# Altium project LSW-MONO.PrjPcb
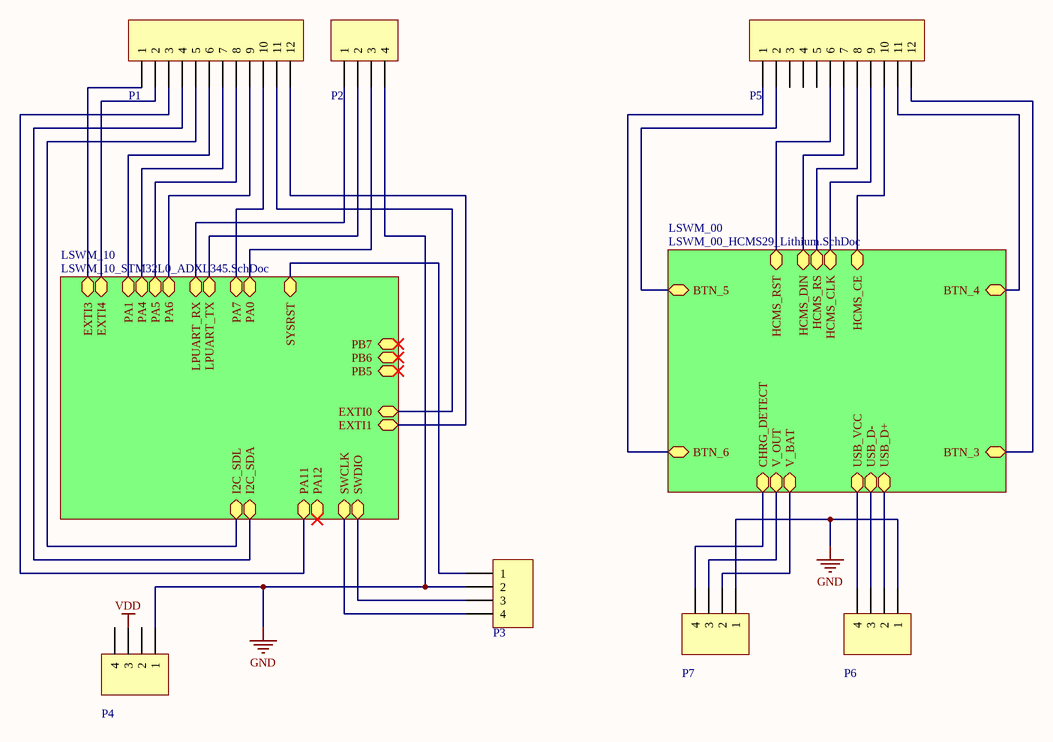
[diagram p0: LSW_0_HCMS29_STM32L0.SchDoc]
3 sheets, 47 parts. Net scope: hierarchical (ports join the sheet entries above them; power ports are global).
Board file: PCB1.PcbDoc
Sheets:
  LSW_0_HCMS29_STM32L0.SchDoc
    LSWM_10 = LSWM_10_STM32L0_ADXL345.SchDoc
    LSWM_00 = LSWM_00_HCMS29_Lithium.SchDoc

## Sheet LSW_0_HCMS29_STM32L0.SchDoc
size A4

### Parts
P1  Header 12  [HDR12X1_1.27mm]  (value not drawn)
P2  Header 4  [HDR4X1_1.27mm]  (value not drawn)
P3  Header 4  [HDR4X1_1.27mm]  (value not drawn)
P4  Header 4  [HDR4X1_1.27mm]  (value not drawn)
P5  Header 12  [HDR12X1_1.27mm]  (value not drawn)
P6  Header 4  [HDR4X1_1.27mm]  (value not drawn)
P7  Header 4  [HDR4X1_1.27mm]  (value not drawn)

### Sub-sheets
LSWM_00 = LSWM_00_HCMS29_Lithium.SchDoc: HCMS_RST, HCMS_DIN, HCMS_RS, HCMS_CLK, HCMS_CE, BTN_3, BTN_4, BTN_5, BTN_6, V_BAT, V_OUT, CHRG_DETECT, USB_VCC, USB_D+, USB_D-
LSWM_10 = LSWM_10_STM32L0_ADXL345.SchDoc: EXTI0, EXTI1, EXTI3, EXTI4, PA7, PA6, PA5, PA4, LPUART_RX, LPUART_TX, SYSRST, SWDIO, SWCLK, PA12, PA11, I2C_SDA, I2C_SDL, PB5, PB6, PB7, PA0, PA1

### Nets
3V3: P7.3 ; sheet LSWM_00/V_OUT
GND: P2.4 P3.2 P4.1 P6.1 P7.1
VBAT: P7.2 ; sheet LSWM_00/V_BAT
VDD: P4.3
STM32L0_EXTI0: P1.11 ; sheet LSWM_10/EXTI0
STM32L0_EXTI1: P1.12 ; sheet LSWM_10/EXTI1
STM32L0_EXTI3: P1.1 ; sheet LSWM_10/EXTI3
STM32L0_EXTI4: P1.2 ; sheet LSWM_10/EXTI4
STM32L0_I2C1_SCL: P1.5 ; sheet LSWM_10/I2C_SDL
STM32L0_I2C1_SDA: P1.4 ; sheet LSWM_10/I2C_SDA
STM32L0_LPUART_RX: P2.1 ; sheet LSWM_10/LPUART_RX
STM32L0_LPUART_TX: P2.2 ; sheet LSWM_10/LPUART_TX
STM32L0_NRST: P3.1 ; sheet LSWM_10/SYSRST
STM32L0_PA0: P2.3 ; sheet LSWM_10/PA0
STM32L0_PA1: P1.6 ; sheet LSWM_10/PA1
STM32L0_PA4: P1.7 ; sheet LSWM_10/PA4
STM32L0_PA5: P1.8 ; sheet LSWM_10/PA5
STM32L0_PA6: P1.9 ; sheet LSWM_10/PA6
STM32L0_PA7: P1.10 ; sheet LSWM_10/PA7
STM32L0_PA11: P1.3 ; sheet LSWM_10/PA11
STM32L0_SWCLK: P3.4 ; sheet LSWM_10/SWCLK
STM32L0_SWDIO: P3.3 ; sheet LSWM_10/SWDIO
NetD1_2: P7.4 ; sheet LSWM_00/CHRG_DETECT
NetJ1_1: P6.4 ; sheet LSWM_00/USB_VCC
NetJ1_2: P6.3 ; sheet LSWM_00/USB_D-
NetJ1_3: P6.2 ; sheet LSWM_00/USB_D+
NetP5_1: P5.1 ; sheet LSWM_00/BTN_6
NetP5_2: P5.2 ; sheet LSWM_00/BTN_5
NetP5_6: P5.6 ; sheet LSWM_00/HCMS_RST
NetP5_7: P5.7 ; sheet LSWM_00/HCMS_DIN
NetP5_8: P5.8 ; sheet LSWM_00/HCMS_RS
NetP5_9: P5.9 ; sheet LSWM_00/HCMS_CLK
NetP5_10: P5.10 ; sheet LSWM_00/HCMS_CE
NetP5_11: P5.11 ; sheet LSWM_00/BTN_4
NetP5_12: P5.12 ; sheet LSWM_00/BTN_3

Not connected (* = marked no-connect by the designer): P4 2 4; P5 3 4 5

### Library data of the parts
P1 P5 = Header 12: 接插件; LatestRevisionDate: 17-Jul-2002; LatestRevisionNote: Re-released for DXP Platform.; Publisher: Altium Limited
P2-P4 P6 P7 = Header 4: 接插件; LatestRevisionDate: 17-Jul-2002; LatestRevisionNote: Re-released for DXP Platform.; Publisher: Altium Limited

## Sheet LSWM_10_STM32L0_ADXL345.SchDoc
size A4
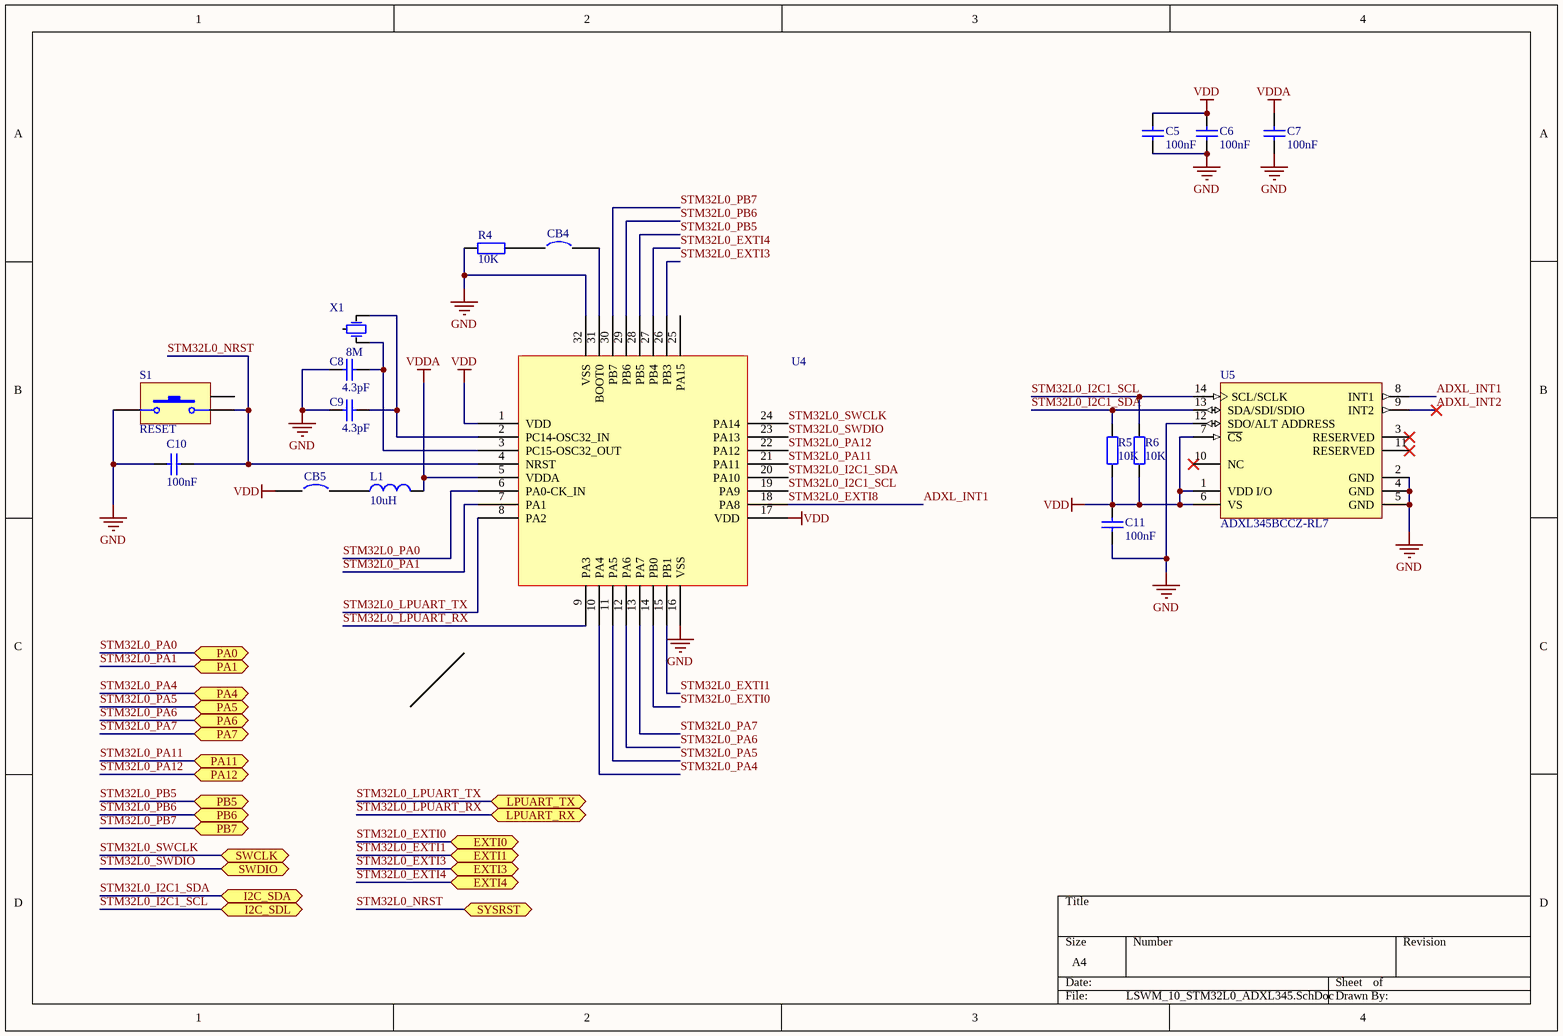
[diagram p1: LSWM_10_STM32L0_ADXL345.SchDoc]

### Parts
C5  value 100nF  [C-RAD-0603]  (hidden comment: Cap)
C6  value 100nF  [C-RAD-0603]  (hidden comment: Cap)
C7  value 100nF  [C-RAD-0603]  (hidden comment: Cap)
C8  value 4.3pF  [C-RAD-0603]  (hidden comment: Cap)
C9  value 4.3pF  [C-RAD-0603]  (hidden comment: Cap)
C10  value 100nF  [C-RAD-0603]  (hidden comment: Cap)
C11  value 100nF  [C-RAD-0603]  (hidden comment: Cap)
CB4  Circuit Breaker  [SB-0805]  (value not drawn)
CB5  Circuit Breaker  [SB-0805]  (value not drawn)
L1  value 10uH  [0805-1]  (hidden comment: Inductor)
R4  value 10K  [0603-1]  (hidden comment: Res1)
R5  value 10K  [0603-1]  (hidden comment: Res1)
R6  value 10K  [0603-1]  (hidden comment: Res1)
S1  RESET  [BTN_2_4_35]
U4  STM32L031K6  [TQFP80P900X900X160-32N]  (value not drawn)
U5  ADXL345BCCZ-RL7  [LGA80P300X500-14N]
X1  value 8M  [X-2X6C - duplicate]  (hidden comment: XTAL_SM)

### Ports
EXTI0 (bidir), EXTI1 (bidir), EXTI3 (bidir), EXTI4 (bidir), I2C_SDA (bidir), I2C_SDL (bidir), LPUART_RX (bidir), LPUART_TX (bidir), PA0 (bidir), PA1 (bidir), PA4 (bidir), PA5 (bidir), PA6 (bidir), PA7 (bidir), PA11 (bidir), PA12 (bidir), PB5 (bidir), PB6 (bidir), PB7 (bidir), SWCLK (bidir), SWDIO (bidir), SYSRST (bidir)

### Nets
GND: C5.2 C6.1 C7.1 C8.1 C9.1 C10.1 C11.1 R4.1 S1.1 U4.16(VSS) U4.32(VSS) U5.2(GND) U5.4(GND) U5.5(GND) U5.12(SDO/ALT_ADDRESS)
VDD: C5.1 C6.2 C11.2 CB5.1 R5.1 R6.1 U4.1(VDD) U4.17(VDD) U5.1(VDD_I/O) U5.6(VS) U5.7(~{CS})
VDDA: C7.2 L1.2 U4.5(VDDA)
ADXL_INT1: U4.18(PA8) U5.8(INT1)  [also labelled STM32L0_EXTI8]
ADXL_INT2: U5.9(INT2)
STM32L0_EXTI0: U4.14(PB0) ; port EXTI0
STM32L0_EXTI1: U4.15(PB1) ; port EXTI1
STM32L0_EXTI3: U4.26(PB3) ; port EXTI3
STM32L0_EXTI4: U4.27(PB4) ; port EXTI4
STM32L0_I2C1_SCL: R6.2 U4.19(PA9) U5.14(SCL/SCLK) ; port I2C_SDL
STM32L0_I2C1_SDA: R5.2 U4.20(PA10) U5.13(SDA/SDI/SDIO) ; port I2C_SDA
STM32L0_LPUART_RX: U4.9(PA3) ; port LPUART_RX
STM32L0_LPUART_TX: U4.8(PA2) ; port LPUART_TX
STM32L0_NRST: C10.2 S1.2 U4.4(NRST) ; port SYSRST
STM32L0_PA0: U4.6(PA0-CK_IN) ; port PA0
STM32L0_PA1: U4.7(PA1) ; port PA1
STM32L0_PA4: U4.10(PA4) ; port PA4
STM32L0_PA5: U4.11(PA5) ; port PA5
STM32L0_PA6: U4.12(PA6) ; port PA6
STM32L0_PA7: U4.13(PA7) ; port PA7
STM32L0_PA11: U4.21(PA11) ; port PA11
STM32L0_PA12: U4.22(PA12) ; port PA12
STM32L0_PB5: U4.28(PB5) ; port PB5
STM32L0_PB6: U4.29(PB6) ; port PB6
STM32L0_PB7: U4.30(PB7) ; port PB7
STM32L0_SWCLK: U4.24(PA14) ; port SWCLK
STM32L0_SWDIO: U4.23(PA13) ; port SWDIO
NetC8_2: C8.2 U4.3(PC15-OSC32_OUT) X1.2(OSC2)
NetC9_2: C9.2 U4.2(PC14-OSC32_IN) X1.1(OSC1)
NetCB4_1: CB4.1 R4.2
NetCB4_2: CB4.2 U4.31(BOOT0)
NetCB5_2: CB5.2 L1.1

Not connected (* = marked no-connect by the designer): S1 3; U4 25(PA15); U5 3(RESERVED)* 10(NC)* 11(RESERVED)*; X1 3

### Library data of the parts
C5-C11 = Cap: 无极性电容; Published: 8-Jun-2000; LatestRevisionDate: 17-Jul-2002; LatestRevisionNote: Re-released for DXP Platform.; PackageReference: RAD-0.3; Publisher: Altium Limited
L1 = Inductor: 电感; Code_IEC: 1005; Published: 8-Jun-2000; LatestRevisionDate: 17-Jul-2002; LatestRevisionNote: Re-released for DXP Platform.; PackageReference: 0402-A; Publisher: Altium Limited; Code_JEITA: 0402
R4-R6 = Res1: 贴片电阻; Published: 8-Jun-2000; LatestRevisionDate: 17-Jul-2002; LatestRevisionNote: Re-released for DXP Platform.; PackageReference: AXIAL-0.4; Publisher: Altium Limited
S1 = SW-PB: 微动开关; Published: 24-Mar-1999; LatestRevisionDate: 17-Jul-2002; LatestRevisionNote: Re-released for DXP Platform.; PackageReference: SPST-2; Publisher: Altium Limited
U5 = ADI-ADXL34X-CC-14-1: 3-Axis, +/-2 g / +/-4 g / +/-8 g / +/-16 g Digital Accelerometer with Digital Output, 1.6 KHz BW, Industrial, 14-pin LGA, Reel
X1 = XTAL_SM: 圆柱晶振; Published: 8-Jun-2000; LatestRevisionDate: 17-Jul-2002; LatestRevisionNote: Re-released for DXP Platform.; PackageReference: R38; Publisher: Altium Limited
CB4 CB5 = Circuit Breaker: Published: 24-Mar-1999; LatestRevisionDate: 17-Jul-2002; LatestRevisionNote: Re-released for DXP Platform.; PackageReference: SPST-2; Publisher: Altium Limited; PackageDescription: Switch; 2 Leads

## Sheet LSWM_00_HCMS29_Lithium.SchDoc
size A4
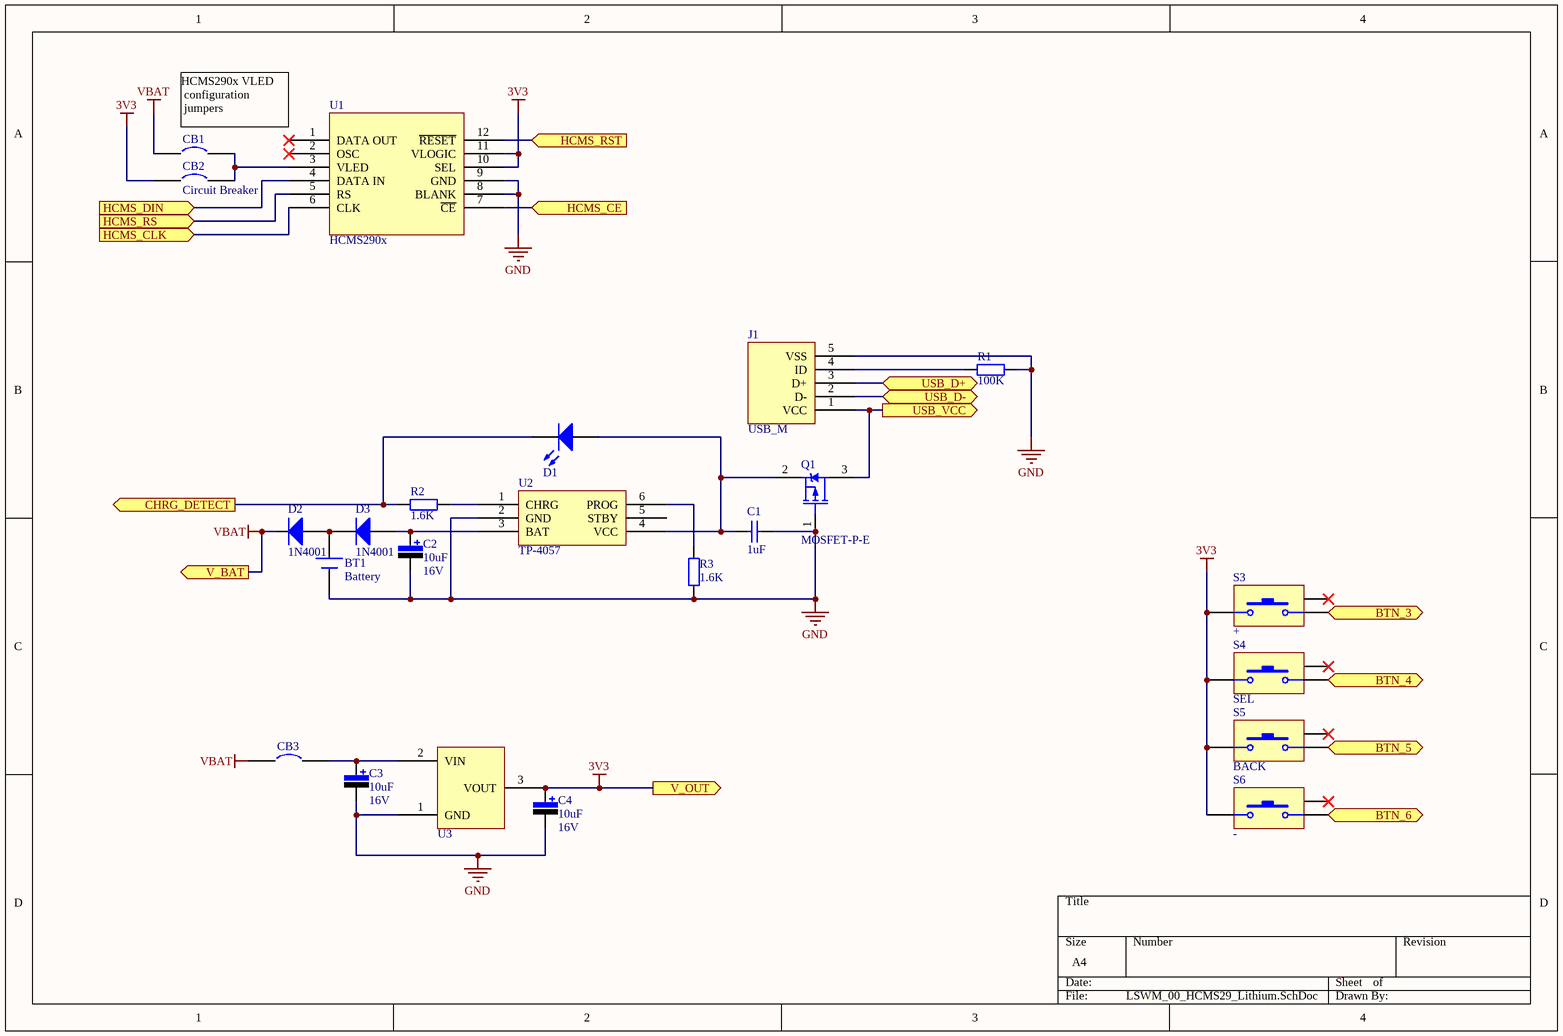
[diagram p2: LSWM_00_HCMS29_Lithium.SchDoc]

### Parts
BT1  Battery  [HDR2X1_A]
C1  value 1uF  [0805-1]  (hidden comment: Cap)
C2  value 10uF  Vol: 16V  [1206-POL]  (hidden comment: Cap Pol)
C3  value 10uF  Vol: 16V  [1206-POL]  (hidden comment: Cap Pol)
C4  value 10uF  Vol: 16V  [1206-POL]  (hidden comment: Cap Pol)
CB1  Circuit Breaker  [SB-0805]  (value not drawn)
CB2  Circuit Breaker  [SB-0805]
CB3  Circuit Breaker  [SB-0805]  (value not drawn)
D1  LED0  [LED_0805]  (value not drawn)
D2  Type: 1N4001  [SOD323]  (hidden comment: Diode)
D3  Type: 1N4001  [SOD323]  (hidden comment: Diode)
J1  USB_M  [USB_MICRO]
Q1  MOSFET-P-E  [SOT-23]
R1  value 100K  [0603-1]  (hidden comment: Res1)
R2  value 1.6K  [0603-1]  (hidden comment: Res1)
R3  value 1.6K  [0805-1]  (hidden comment: Res1)
S3  +  [BTN_2_4_35]
S4  SEL  [BTN_2_4_35]
S5  BACK  [BTN_2_4_35]
S6  -  [BTN_2_4_35]
U1  HCMS290x  [HCMS-290x]
U2  TP-4057  [SOT23-6]
U3  HT73xx  [SOT89N]  (value not drawn)

### Ports
BTN_3 (out), BTN_4 (out), BTN_5 (out), BTN_6 (out), CHRG_DETECT (out), HCMS_CE (in), HCMS_CLK (in), HCMS_DIN (in), HCMS_RS (in), HCMS_RST (in), USB_D+ (bidir), USB_D- (bidir), USB_VCC (out), V_BAT (out), V_OUT (out)

### Nets
3V3: C4.1 CB2.1 S3.1 S4.1 S5.1 S6.1 U1.10(SEL) U1.11(VLOGIC) U3.3(VOUT) ; port V_OUT
GND: BT1.2(-) C1.2 C2.2 C3.2 C4.2 J1.5(VSS) Q1.1(G) R1.2 R3.1 U1.8(BLANK) U1.9(GND) U2.2(GND) U3.1(GND)
VBAT: CB1.1 CB3.1 D2.2(K) ; port V_BAT
NetBT1_1: BT1.1(+) D2.1(A) D3.2(K)
NetC1_1: C1.1 D1.1(A) Q1.2(S) U2.4(VCC)
NetC2_1: C2.1 D3.1(A) U2.3(BAT)
NetC3_1: C3.1 CB3.2 U3.2(VIN)
NetCB1_2: CB1.2 CB2.2 U1.3(VLED)
NetD1_2: D1.2(K) R2.2 ; port CHRG_DETECT
NetJ1_1: J1.1(VCC) Q1.3(D) ; port USB_VCC
NetJ1_2: J1.2(D-) ; port USB_D-
NetJ1_3: J1.3(D+) ; port USB_D+
NetJ1_4: J1.4(ID) R1.1
NetP5_1: S6.2 ; port BTN_6
NetP5_2: S5.2 ; port BTN_5
NetP5_6: U1.12(~{RESET}) ; port HCMS_RST
NetP5_7: U1.4(DATA_IN) ; port HCMS_DIN
NetP5_8: U1.5(RS) ; port HCMS_RS
NetP5_9: U1.6(CLK) ; port HCMS_CLK
NetP5_10: U1.7(~{CE}) ; port HCMS_CE
NetP5_11: S4.2 ; port BTN_4
NetP5_12: S3.2 ; port BTN_3
NetR2_1: R2.1 U2.1(CHRG)
NetR3_2: R3.2 U2.6(PROG)

Not connected (* = marked no-connect by the designer): S3 3*; S4 3*; S5 3*; S6 3*; U1 1(DATA_OUT)* 2(OSC)*; U2 5(STBY)

### Notes on the sheet
- HCMS290x VLED
  configuration
  jumpers

### Library data of the parts
BT1 = Battery_1: 备份电池; Published: 24-Mar-1999; LatestRevisionDate: 17-Jul-2002; LatestRevisionNote: Re-released for DXP Platform.; PackageReference: BAT-2; Publisher: Altium Limited
C1 = Cap: 无极性电容; Published: 8-Jun-2000; LatestRevisionDate: 17-Jul-2002; LatestRevisionNote: Re-released for DXP Platform.; PackageReference: RAD-0.3; Publisher: Altium Limited
C2-C4 = Cap Pol: 极性电解电容; Published: 8-Jun-2000; LatestRevisionDate: 17-Jul-2002; LatestRevisionNote: Re-released for DXP Platform.; PackageReference: RB7.6-15; Publisher: Altium Limited
D1 = LED0: 发光二极管; Published: 8-Jun-2000; LatestRevisionDate: 08-Jul-2005; LatestRevisionNote: Mech Layer 1 removed.; PackageReference: LED-0; Publisher: Altium Limited
D2 D3 = Diode: 二极管; Published: 8-Jun-2000; LatestRevisionDate: 17-Jul-2002; LatestRevisionNote: Re-released for DXP Platform.; PackageDocument: Sep-1996; PackageReference: SMC; Publisher: Altium Limited; Code_JEDEC: DO-214-AB
J1 = USB_M: MicroUSB接口
Q1 = MOSFET-P-E: P-Channel Enhanced MOSFET; PackageDocument: 1995/1996; Published: 8-Jun-2000; LatestRevisionDate: 17-Jul-2002; LatestRevisionNote: Re-released for DXP Platform.; PackageReference: E3; Publisher: Altium Limited
R1-R3 = Res1: 贴片电阻; Published: 8-Jun-2000; LatestRevisionDate: 17-Jul-2002; LatestRevisionNote: Re-released for DXP Platform.; PackageReference: AXIAL-0.4; Publisher: Altium Limited
S3-S6 = SW-PB: 微动开关; Published: 24-Mar-1999; LatestRevisionDate: 17-Jul-2002; LatestRevisionNote: Re-released for DXP Platform.; PackageReference: SPST-2; Publisher: Altium Limited
U1 = HCMS290x: HCMS LED display module
U2 = TP-4057: 500mA Linear Lithium Battery Charger
CB1-CB3 = Circuit Breaker: Published: 24-Mar-1999; LatestRevisionDate: 17-Jul-2002; LatestRevisionNote: Re-released for DXP Platform.; PackageReference: SPST-2; Publisher: Altium Limited; PackageDescription: Switch; 2 Leads
U3 = HT73xx: Output Voltage: *

## Nets that join several sheets
3V3: LSW_0_HCMS29_STM32L0 (P7.3), LSWM_00_HCMS29_Lithium (9 pins)
GND: LSW_0_HCMS29_STM32L0 (5 pins), LSWM_10_STM32L0_ADXL345 (15 pins), LSWM_00_HCMS29_Lithium (13 pins)
VBAT: LSW_0_HCMS29_STM32L0 (P7.2), LSWM_00_HCMS29_Lithium (CB1.1 CB3.1 D2.2)
VDD: LSW_0_HCMS29_STM32L0 (P4.3), LSWM_10_STM32L0_ADXL345 (11 pins)
NetD1_2: LSW_0_HCMS29_STM32L0 (P7.4), LSWM_00_HCMS29_Lithium (D1.2 R2.2)
NetJ1_1: LSW_0_HCMS29_STM32L0 (P6.4), LSWM_00_HCMS29_Lithium (J1.1 Q1.3)
NetJ1_2: LSW_0_HCMS29_STM32L0 (P6.3), LSWM_00_HCMS29_Lithium (J1.2)
NetJ1_3: LSW_0_HCMS29_STM32L0 (P6.2), LSWM_00_HCMS29_Lithium (J1.3)
NetP5_1: LSW_0_HCMS29_STM32L0 (P5.1), LSWM_00_HCMS29_Lithium (S6.2)
NetP5_2: LSW_0_HCMS29_STM32L0 (P5.2), LSWM_00_HCMS29_Lithium (S5.2)
NetP5_6: LSW_0_HCMS29_STM32L0 (P5.6), LSWM_00_HCMS29_Lithium (U1.12)
NetP5_7: LSW_0_HCMS29_STM32L0 (P5.7), LSWM_00_HCMS29_Lithium (U1.4)
NetP5_8: LSW_0_HCMS29_STM32L0 (P5.8), LSWM_00_HCMS29_Lithium (U1.5)
NetP5_9: LSW_0_HCMS29_STM32L0 (P5.9), LSWM_00_HCMS29_Lithium (U1.6)
NetP5_10: LSW_0_HCMS29_STM32L0 (P5.10), LSWM_00_HCMS29_Lithium (U1.7)
NetP5_11: LSW_0_HCMS29_STM32L0 (P5.11), LSWM_00_HCMS29_Lithium (S4.2)
NetP5_12: LSW_0_HCMS29_STM32L0 (P5.12), LSWM_00_HCMS29_Lithium (S3.2)
STM32L0_EXTI0: LSW_0_HCMS29_STM32L0 (P1.11), LSWM_10_STM32L0_ADXL345 (U4.14)
STM32L0_EXTI1: LSW_0_HCMS29_STM32L0 (P1.12), LSWM_10_STM32L0_ADXL345 (U4.15)
STM32L0_EXTI3: LSW_0_HCMS29_STM32L0 (P1.1), LSWM_10_STM32L0_ADXL345 (U4.26)
STM32L0_EXTI4: LSW_0_HCMS29_STM32L0 (P1.2), LSWM_10_STM32L0_ADXL345 (U4.27)
STM32L0_I2C1_SCL: LSW_0_HCMS29_STM32L0 (P1.5), LSWM_10_STM32L0_ADXL345 (R6.2 U4.19 U5.14)
STM32L0_I2C1_SDA: LSW_0_HCMS29_STM32L0 (P1.4), LSWM_10_STM32L0_ADXL345 (R5.2 U4.20 U5.13)
STM32L0_LPUART_RX: LSW_0_HCMS29_STM32L0 (P2.1), LSWM_10_STM32L0_ADXL345 (U4.9)
STM32L0_LPUART_TX: LSW_0_HCMS29_STM32L0 (P2.2), LSWM_10_STM32L0_ADXL345 (U4.8)
STM32L0_NRST: LSW_0_HCMS29_STM32L0 (P3.1), LSWM_10_STM32L0_ADXL345 (C10.2 S1.2 U4.4)
STM32L0_PA0: LSW_0_HCMS29_STM32L0 (P2.3), LSWM_10_STM32L0_ADXL345 (U4.6)
STM32L0_PA1: LSW_0_HCMS29_STM32L0 (P1.6), LSWM_10_STM32L0_ADXL345 (U4.7)
STM32L0_PA4: LSW_0_HCMS29_STM32L0 (P1.7), LSWM_10_STM32L0_ADXL345 (U4.10)
STM32L0_PA5: LSW_0_HCMS29_STM32L0 (P1.8), LSWM_10_STM32L0_ADXL345 (U4.11)
STM32L0_PA6: LSW_0_HCMS29_STM32L0 (P1.9), LSWM_10_STM32L0_ADXL345 (U4.12)
STM32L0_PA7: LSW_0_HCMS29_STM32L0 (P1.10), LSWM_10_STM32L0_ADXL345 (U4.13)
STM32L0_PA11: LSW_0_HCMS29_STM32L0 (P1.3), LSWM_10_STM32L0_ADXL345 (U4.21)
STM32L0_SWCLK: LSW_0_HCMS29_STM32L0 (P3.4), LSWM_10_STM32L0_ADXL345 (U4.24)
STM32L0_SWDIO: LSW_0_HCMS29_STM32L0 (P3.3), LSWM_10_STM32L0_ADXL345 (U4.23)